# Altium schematic sheet 00.Cover Page.SchDoc
size 297 x 209 mm; Revision: V2.1; Schematic Page Number: 11; Page Number: 1; Check: Default; Schematic Name: RK_NVR_DEMO1_RK3588_LP4/4x_V21; Page Count: 43; Page name: 00.Cover Page; Designer: Zhangdz; Schematic Page Count: 99; Revcode: V2.1; DsnPath: E:\Work\SBER\RK3588_SOM\temp\RK_NVR_DEMO1_RK3588_LP4XD200P232SD8_V21_20211228.DSN; SchematicName: RK_NVR_DEMO1_RK3588_LP4/4x_V21; PageName: 00.Cover Page; PageSize: A4; TopSchematic: True
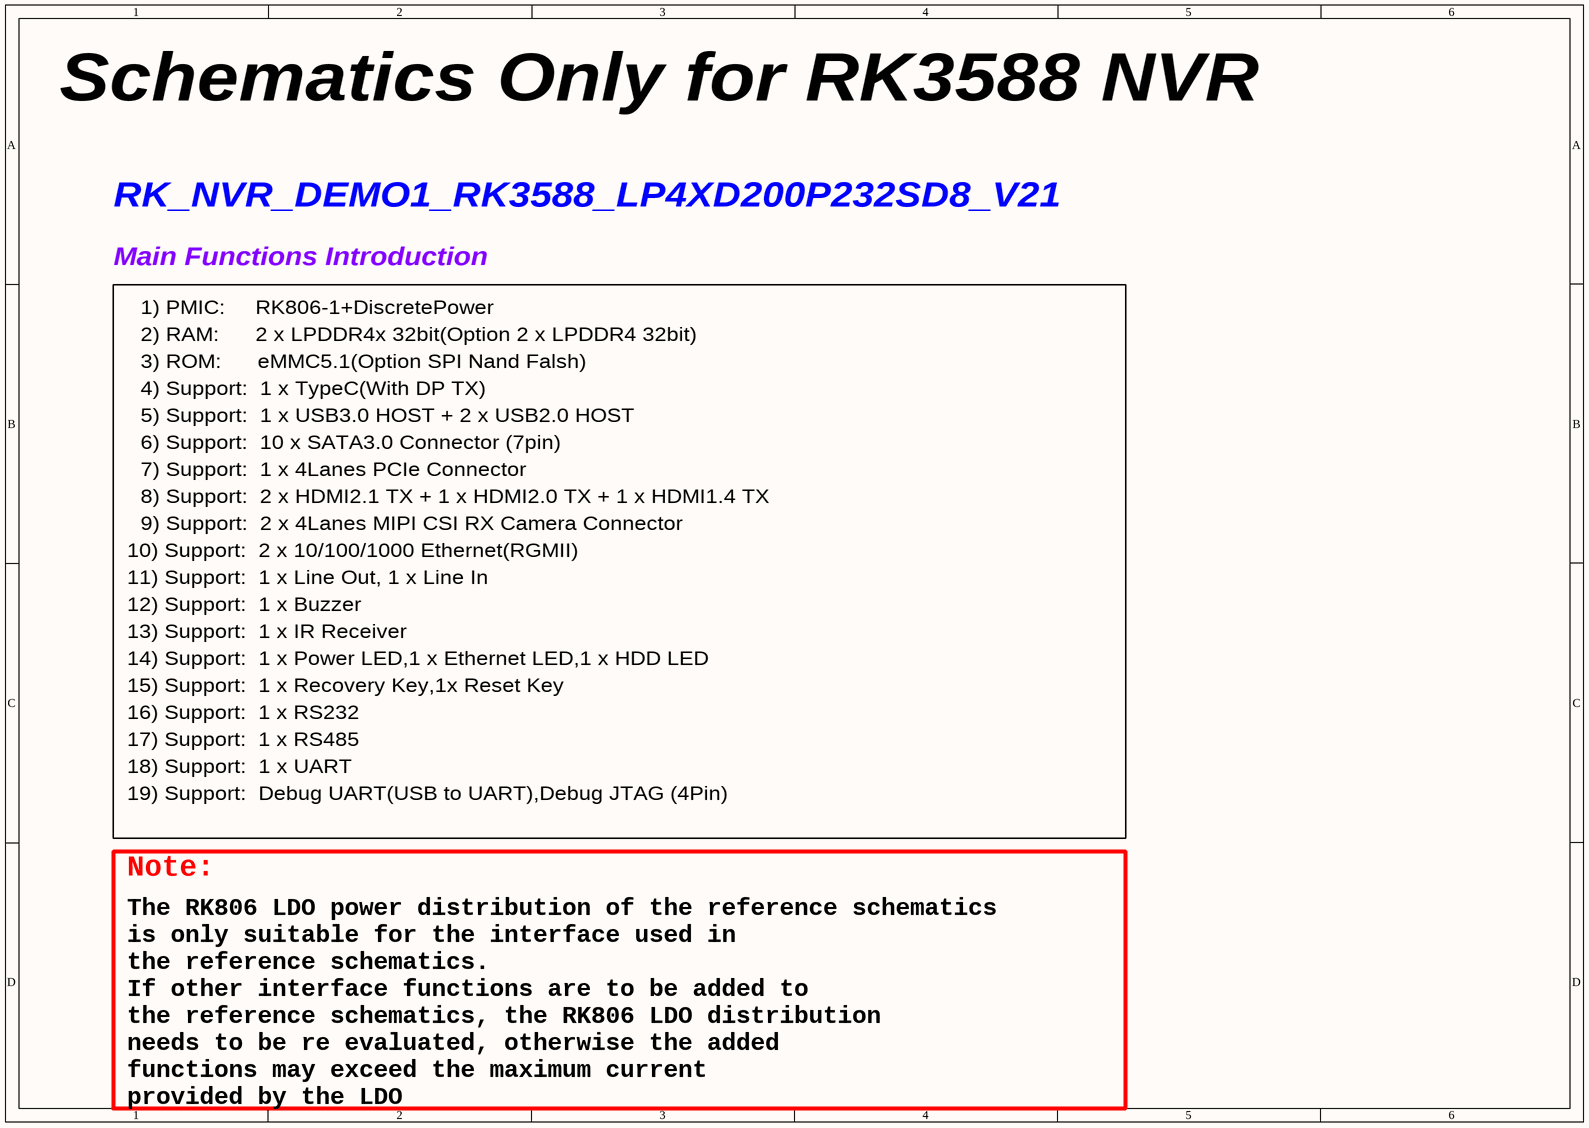
[diagram p0: 00.Cover Page.SchDoc]

## Notes on the sheet
- Schematics Only for RK3588 NVR
- RK_NVR_DEMO1_RK3588_LP4XD200P232SD8_V21
- Main Functions Introduction
- 1) PMIC:     RK806-1+DiscretePower
- 2) RAM:      2 x LPDDR4x 32bit(Option 2 x LPDDR4 32bit)
- 3) ROM:      eMMC5.1(Option SPI Nand Falsh)
- 4) Support:  1 x TypeC(With DP TX)
- 5) Support:  1 x USB3.0 HOST + 2 x USB2.0 HOST
- 6) Support:  10 x SATA3.0 Connector (7pin)
- 9) Support:  2 x 4Lanes MIPI CSI RX Camera Connector
- 7) Support:  1 x 4Lanes PCIe Connector
- 8) Support:  2 x HDMI2.1 TX + 1 x HDMI2.0 TX + 1 x HDMI1.4 TX
- 10) Support:  2 x 10/100/1000 Ethernet(RGMII)
- 11) Support:  1 x Line Out, 1 x Line In
- 13) Support:  1 x IR Receiver
- 14) Support:  1 x Power LED,1 x Ethernet LED,1 x HDD LED
- 12) Support:  1 x Buzzer
- 15) Support:  1 x Recovery Key,1x Reset Key
- 16) Support:  1 x RS232
- 19) Support:  Debug UART(USB to UART),Debug JTAG (4Pin)
- 17) Support:  1 x RS485
- 18) Support:  1 x UART
- Note:
- The RK806 LDO power distribution of the reference schematics
  is only suitable for the interface used in
  the reference schematics.
  If other interface functions are to be added to
  the reference schematics, the RK806 LDO distribution
  needs to be re evaluated, otherwise the added
  functions may exceed the maximum current
  provided by the LDO